# Altium schematic sheet PowerDistribution_1.SchDoc
size B; Organization: ORGANIZATION; Address1: ADDRESS 1; Address2: ADDRESS 2; Address3: ADDRESS 3; Address4: ADDRESS 4; Revision: -; SheetNumber: 1; SheetTotal: 1; ENG_APP_DATE: --/--/--; DSN_APP_DATE: --/--/--; CHK_APP_DATE: --/--/--
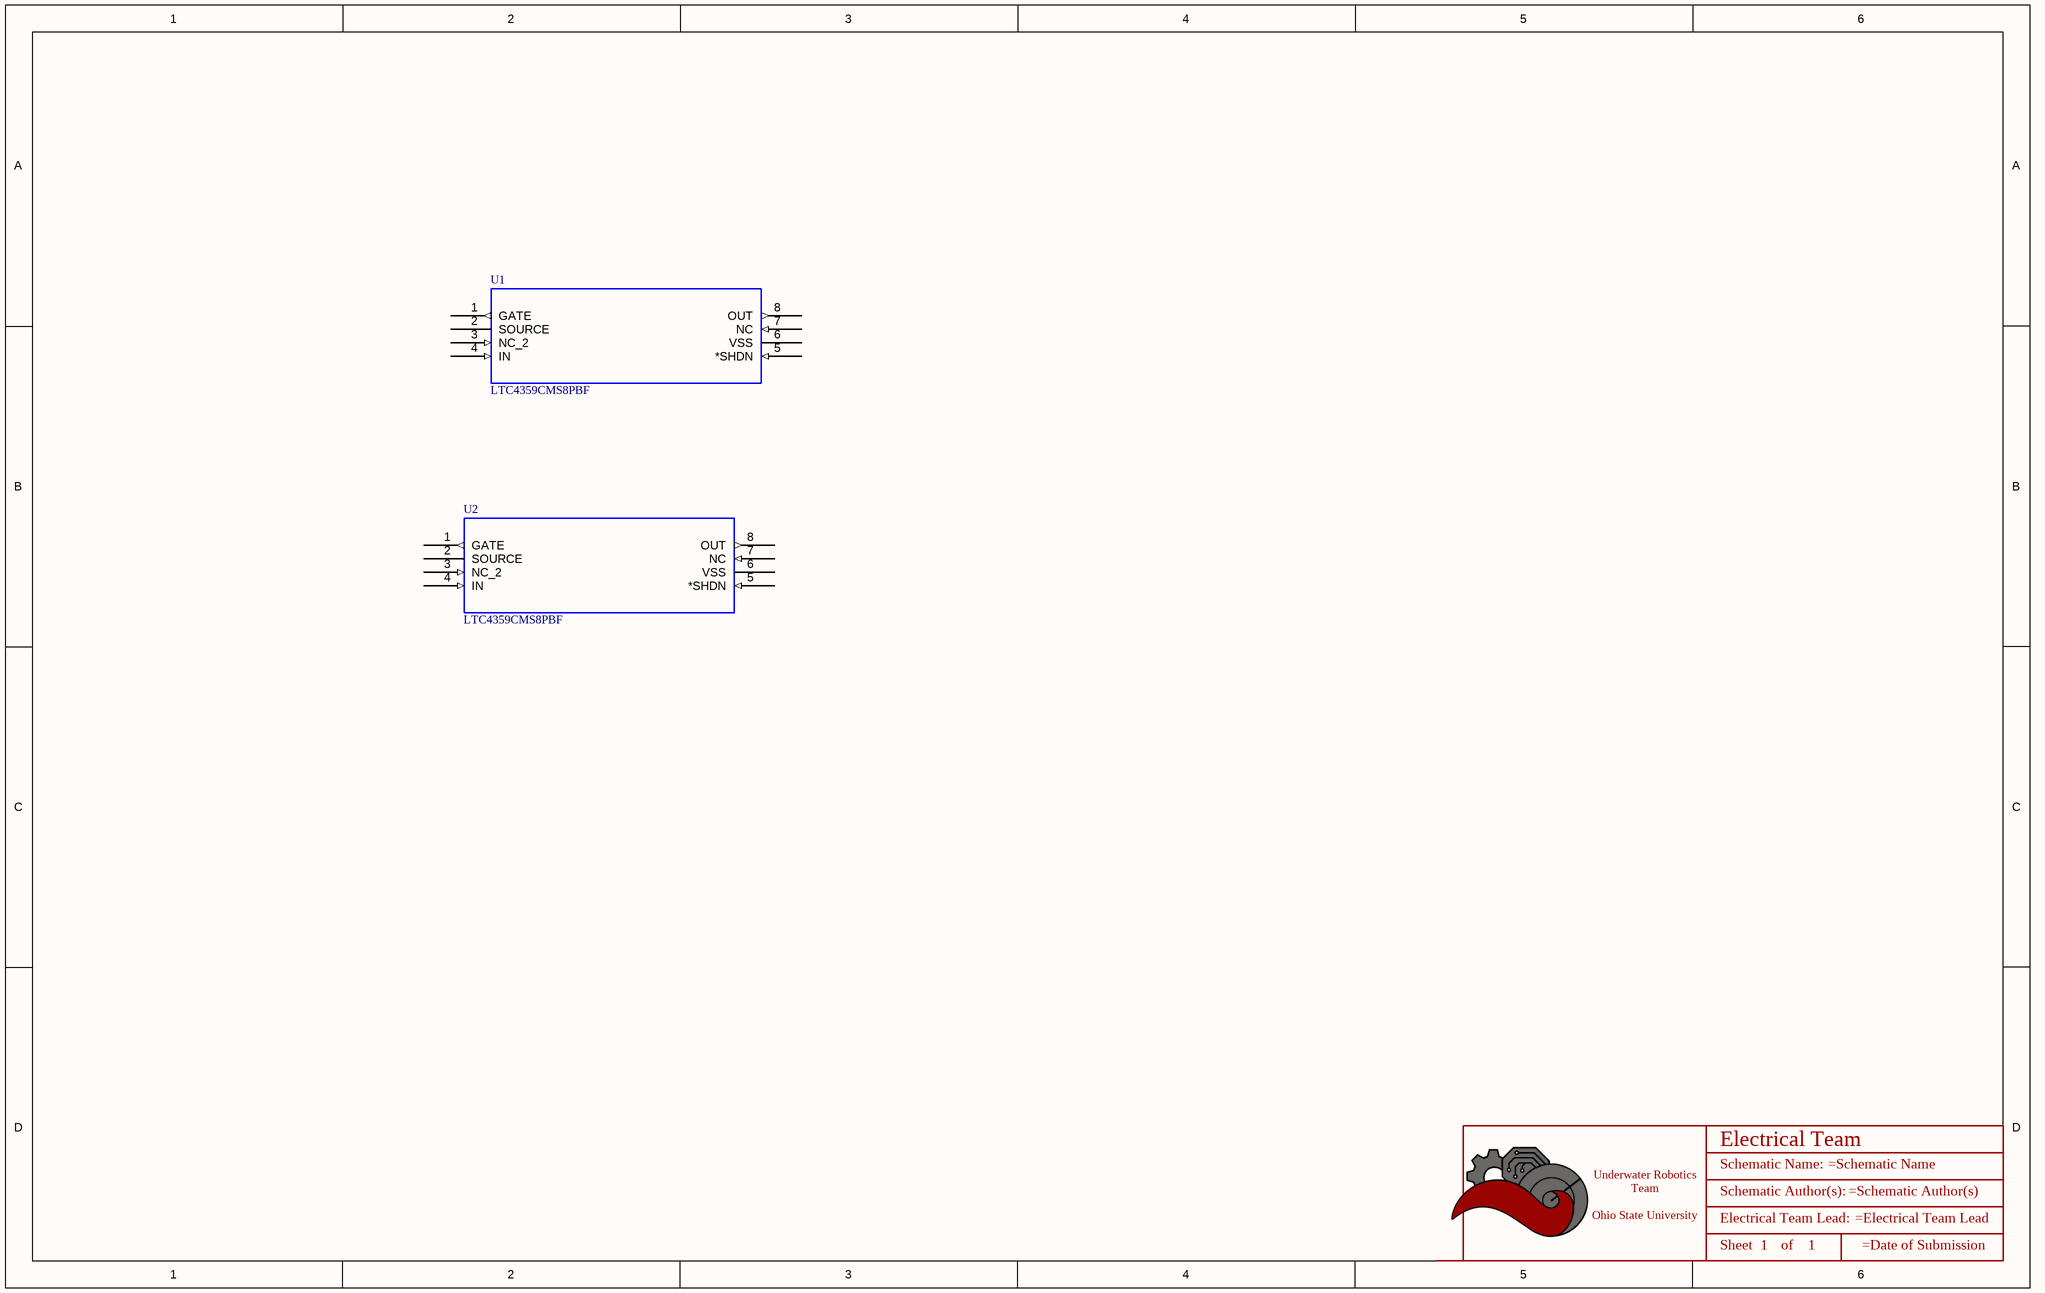
[diagram p0: PowerDistribution_1.SchDoc]

## Parts
*  Title_Block  (value not drawn)  (graphical)
U1  LTC4359CMS8PBF  [MSOP-8_MS]
U2  LTC4359CMS8PBF  [MSOP-8_MS]

## Nets

Not connected (* = marked no-connect by the designer): U1 1(GATE) 2(SOURCE) 3(NC_2) 4(IN) 5(*SHDN) 6(VSS) 7(NC) 8(OUT); U2 1(GATE) 2(SOURCE) 3(NC_2) 4(IN) 5(*SHDN) 6(VSS) 7(NC) 8(OUT)

## Notes on the sheet
- DWG. NO.
- REV.
- SHT.
- THIS DOCUMENT AND THE DATA DISCLOSED HEREIN OR HEREWITH IS THE PROPERTY OF ALTIUM LIMITED AND MAY BE FREELY DISTRIBUTED IN WHOLE. NO RIGHTS ARE RESERVED OR EXPRESS OR IMPLIED WARANTEE GIVEN.
- REVISION
- DESCRIPTION
- DATE
- APPROVED
- ENG:
- APPROVALS
- PROJECT
- DSN:
- CHK:
- REFERENCE DOCUMENTS
- PROJECT REVISION:
- TITLE
- DOCUMENT REVISION:
- DESIGN ITEM:
- BOM:
- FAB DWG:
- PCB DWG:
- ASSY DWG:
- SCALE:
- SIZE
- B
- CAGE CODE
- FILE NAME
- DWG NO.
- SHEET
- OF
- REV
- (in symbol Title_Block) Electrical Team; Schematic Name:; Schematic Author(s):; Underwater Robotics Team / Ohio State University; Electrical Team Lead:; Sheet; of

## Library data of the parts
* = Title_Block: UWRT Schematic Title Block Template / Created June 2021, Dylan Trainor
U1 U2 = LTC4359CMS8PBF: IC OR CTRLR N+1 8MSOP,  IDEAL DIODE CONTROLLER; MF: Linear Technology; MP: LTC4359CMS8#PBF; Package: MSOP-8 Linear Technology; SnapEDA_Link: https://www.snapeda.com/parts/LTC4359CMS8%23PBF/Analog%20Devices/view-part/448959/?ref=snap; Mouser-Purchase-URL: https://snapeda.com/shop?store=Mouser&id=448959; DigiKey-Purchase-URL: https://snapeda.com/shop?store=DigiKey&id=448959; Price: None; Availability: Unavailable; Value: *